# EAGLE design v2 schematic (EAGLE 7.1.0)
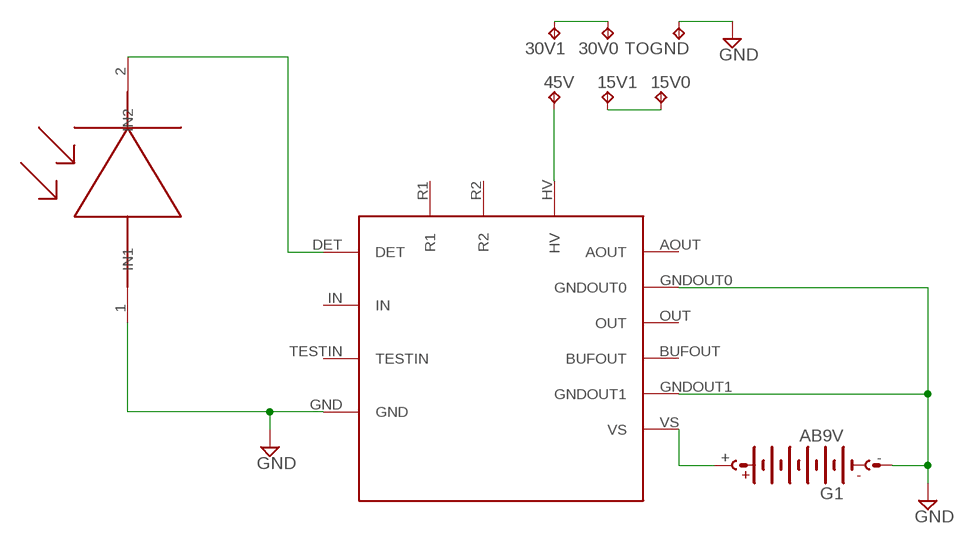
[diagram p0: schematic, sheet 1]

## Parts
15V0  TP-063  [TP-063]
15V1  TP-063  [TP-063]
30V0  TP-063  [TP-063]
30V1  TP-063  [TP-063]
45V  TP-063  [TP-063]
G1  AB9V  [AB9V]
PC21  A111  [A111]
PINDIODE  S3590-08  [S3590-08]
TOGND  TP-063  [TP-063]

## Nets
GND: G1.- PC21.GND PC21.GNDOUT0 PC21.GNDOUT1 PINDIODE.1(IN1) TOGND.1
N$1: 45V.1 PC21.HV
N$2: 30V0.1 30V1.1
N$3: 15V0.1 15V1.1
N$4: G1.+ PC21.VS
N$6: PC21.DET PINDIODE.2(IN2)
Unconnected: PC21.AOUT PC21.BUFOUT PC21.IN PC21.OUT PC21.R1 PC21.R2 PC21.TESTIN

## Library data of the parts
15V0 15V1 30V0 30V1 45V TOGND = keystone:TP: TEST POINT PCB Vertical Mount
G1 = battery:AB9V: 9-V BATTERY CLIP
PC21 = SHARD:A111
PINDIODE = SHARD:S3590-08

## Board
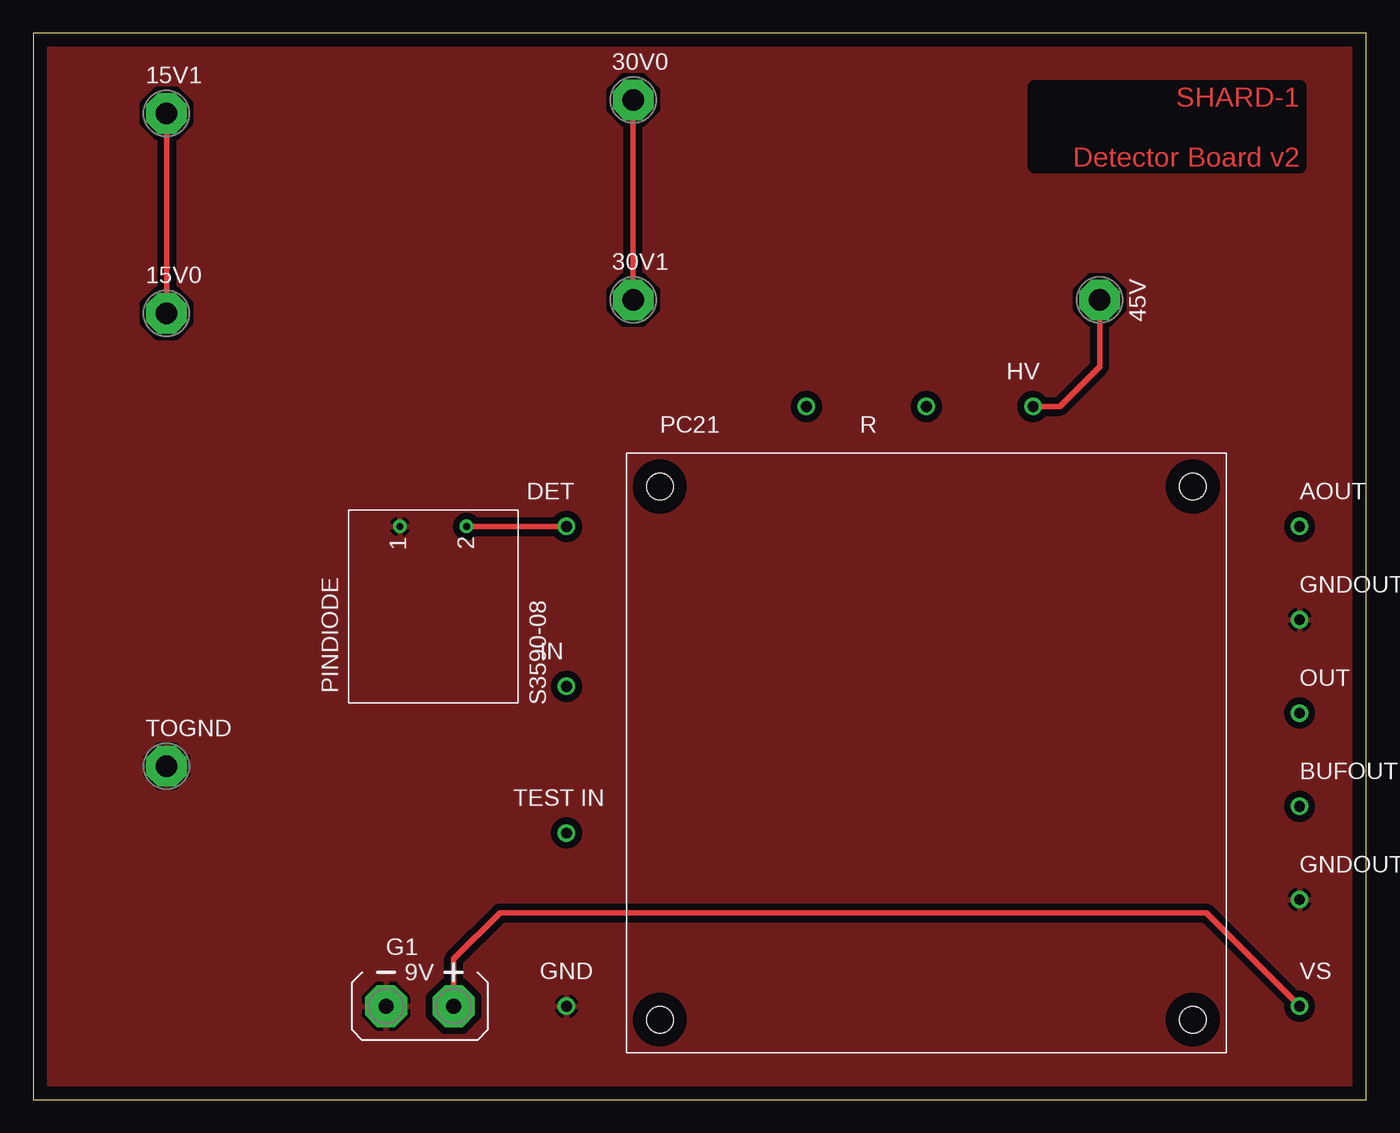
[diagram p1: board, top side]

Size 100 x 80 mm. Coordinates in mm from the lower left corner, seen from the top.
Outline: 0,0 100,0 100,80 0,80 0,0
Copper layers (1*16): Top 0.035mm / dielectric 1.5mm / Bottom 0.035mm
Design rules "default": minimum track width 10mil, minimum drill 24mil, track to track 8mil, track to pad 8mil, pad to pad 8mil, via to via 8mil, smd to smd 8mil, copper to edge 40mil, drill to drill 8mil, minimum pad ring 10mil, minimum via ring 8mil, stop-mask expansion 4mil, vias tented up to drill 0mil, thermal gap 10mil
Holes 2 mm at 47,46 87,46 87,6 47,6

### Footprints (pad centres in the part's own frame; a part is rotated, then mirrored left to right if it is on the bottom)
TP-063 = drill 1.6 pad 3.048 octagon: 1 0,0
AB9V = drill 1.118 pad 3.15 octagon: + 0,2.54; - 0,-2.54
A111 = drill 0.8: AOUT 28,17; BUFOUT 28,-4; DET -27,17; GND -27,-19; GNDOUT0 28,10; GNDOUT1 28,-11; HV 8,26; IN -27,5; OUT 28,3; R1 -9,26; R2 0,26; TESTIN -27,-6; VS 28,-19
S3590-08 = drill 0.5: 1 6,2.5; 2 6,-2.5

### Placement (x,y rotation side)
15V0  10,59 0 top
15V1  10,74 0 top
30V0  45,75 0 top
30V1  45,60 0 top
45V  80,60 270 top
G1  29,7 270 top
PC21  67,26 0 top
PINDIODE  30,37 90 top
TOGND  10,25 0 top

### Tracks (layer width: path | path; a pad name or v marks a point on that pad's centre or on a via)
GND
  pour Top (isolate 0.5): 0,0 100,0 100,80 0,80 0,78
N$1
  Top 0.406: PC21.HV 77,52 80,55 45V.1
N$2
  Top 0.406: 30V1.1 30V0.1
N$3
  Top 0.406: 15V1.1 15V0.1
N$4
  Top 0.406: G1.+ 31.54,10.54 35,14 88,14 PC21.VS
N$6
  Top 0.406: PINDIODE.2 PC21.DET

### Text on the board
Top: SHARD-1 / / Detector Board v2